# EAGLE design PCB_Nano (EAGLE 9.6.2)
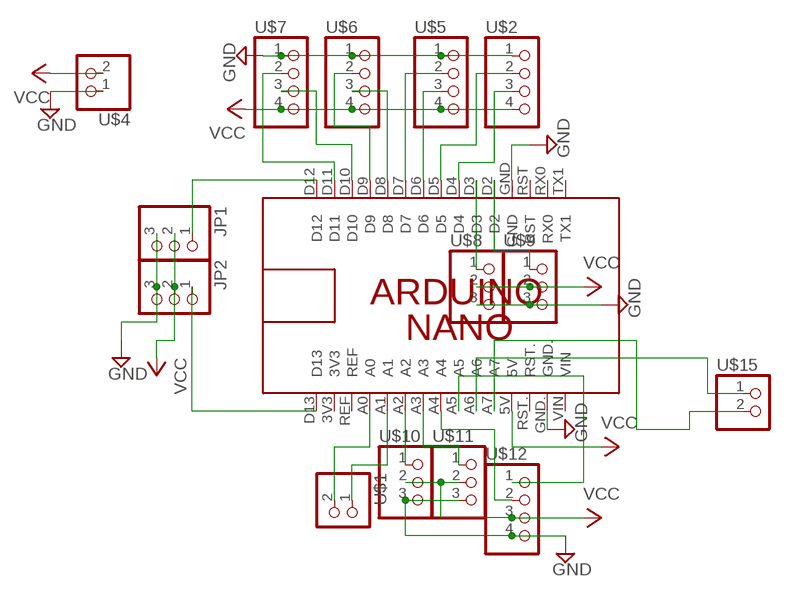
[diagram p0: schematic, sheet 1]

## Parts
JP1  PINHD-1X3  [1X03]
JP2  PINHD-1X3  [1X03]
PCB1  ARDUINO_NANO_SHIELD  [ARDUINO_NANO_W_HEADER_&_SOCKET]
U$1  PINHD-1X2  [1X02]
U$2  PINHD-1X4  [1X04]
U$4  TERMINALBLOCK_1X2-5.0MM  [TERMINALBLOCK_1X2-5.0MM]
U$5  PINHD-1X4  [1X04]
U$6  PINHD-1X4  [1X04]
U$7  PINHD-1X4  [1X04]
U$8  PINHD-1X3  [1X03]
U$9  PINHD-1X3  [1X03]
U$10  PINHD-1X3  [1X03]
U$11  PINHD-1X3  [1X03]
U$12  PINHD-1X4  [1X04]
U$15  PINHD-1X2  [1X02]

## Nets
GND: JP1.3 JP2.3 PCB1.GND PCB1.GND. U$2.1 U$4.1 U$5.1 U$6.1 U$7.1 U$8.3 U$9.3 U$10.3 U$11.3 U$12.4
N$1: PCB1.D4 U$2.3
N$2: PCB1.D5 U$2.2
N$3: PCB1.D6 U$5.3
N$4: PCB1.D7 U$5.2
N$5: PCB1.D8 U$6.3
N$6: PCB1.D9 U$6.2
N$7: PCB1.D10 U$7.3
N$8: PCB1.D11 U$7.2
N$9: PCB1.A1 U$1.1
N$10: PCB1.A0 U$1.2
N$11: PCB1.D3 U$8.1
N$12: PCB1.D2 U$9.1
N$13: JP1.1 PCB1.D12
N$14: JP2.1 PCB1.D13
N$15: PCB1.A2 U$10.1
N$16: PCB1.A3 U$11.1
N$17: PCB1.A4 U$12.2
N$18: PCB1.A5 U$12.1
N$19: PCB1.A6 U$15.1
N$20: PCB1.A7 U$15.2
VCC: JP1.2 JP2.2 PCB1.5V U$2.4 U$4.2 U$5.4 U$6.4 U$7.4 U$8.2 U$9.2 U$10.2 U$11.2 U$12.3
Unconnected: PCB1.3V3 PCB1.REF PCB1.RST PCB1.RST. PCB1.RX0 PCB1.TX1 PCB1.VIN

## Library data of the parts
JP1 JP2 U$8-U$11 = pinhead:PINHD-1X3: PIN HEADER
PCB1 = Arduino_Shield:ARDUINO_NANO_SHIELD: Base shield for Arduino Nano board.
U$1 U$15 = pinhead:PINHD-1X2: PIN HEADER
U$2 U$5-U$7 U$12 = pinhead:PINHD-1X4: PIN HEADER
U$4 = TerminalBlock:TERMINALBLOCK_1X2-5.0MM: 1x2-5.0MM TERMINAL BLOCK Simple screw terminal. 2 pins with 5.0mm pitch; PITCH: 5mm

## Board
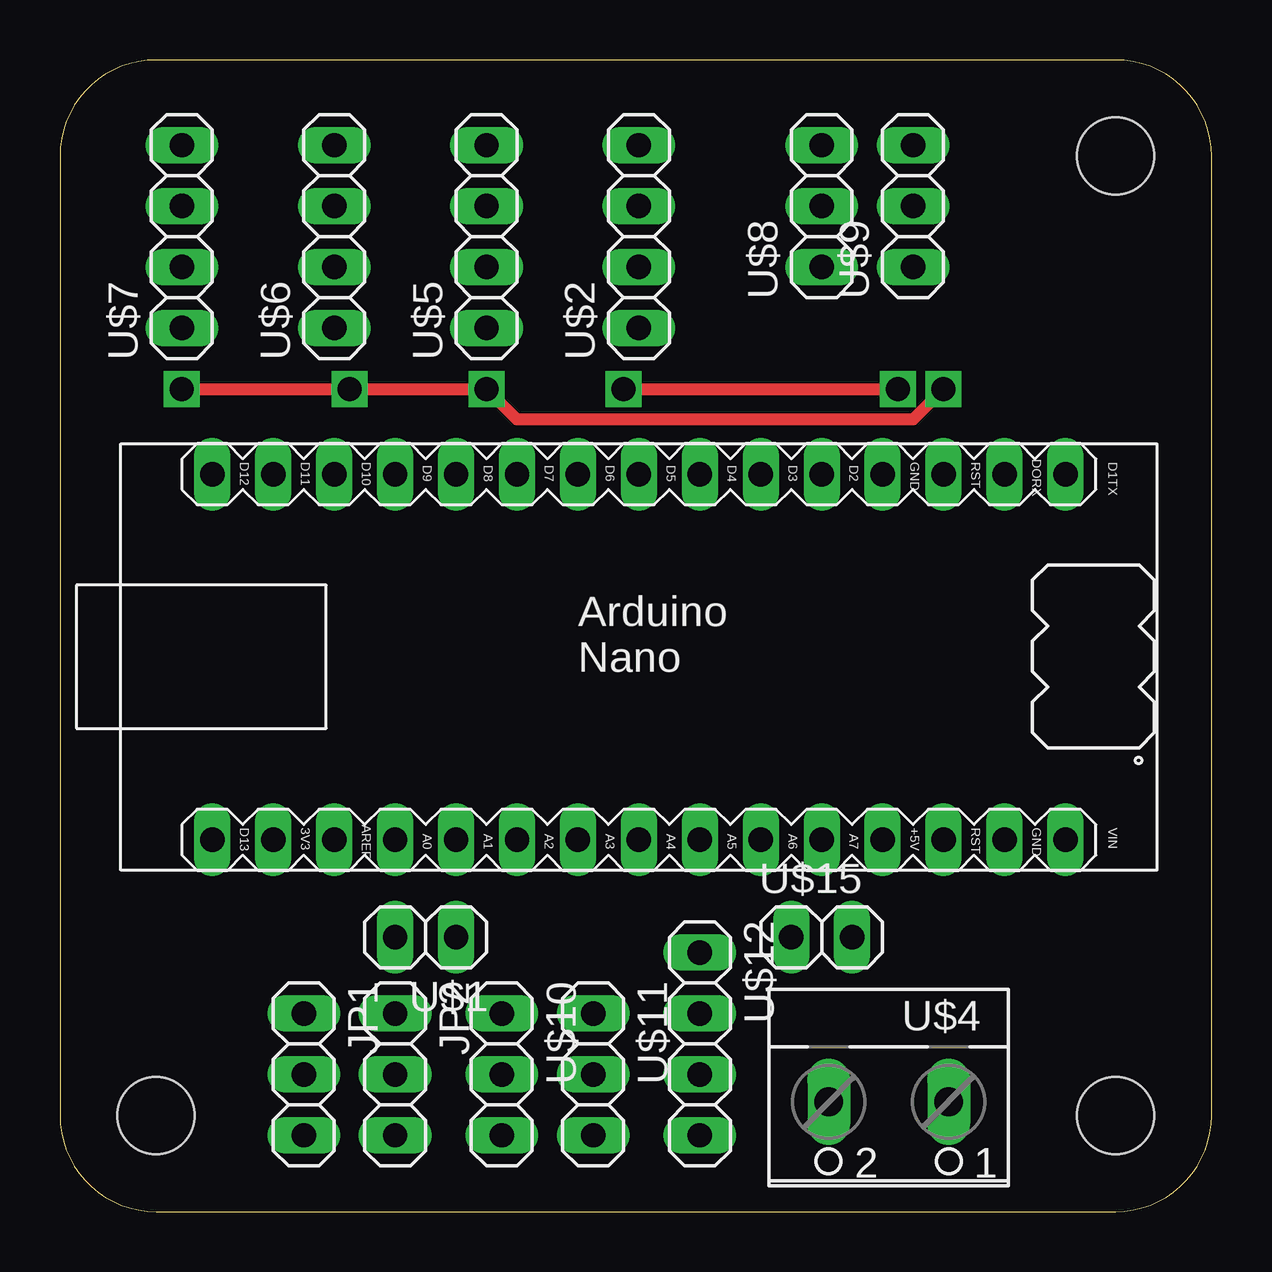
[diagram p1: board, top side]
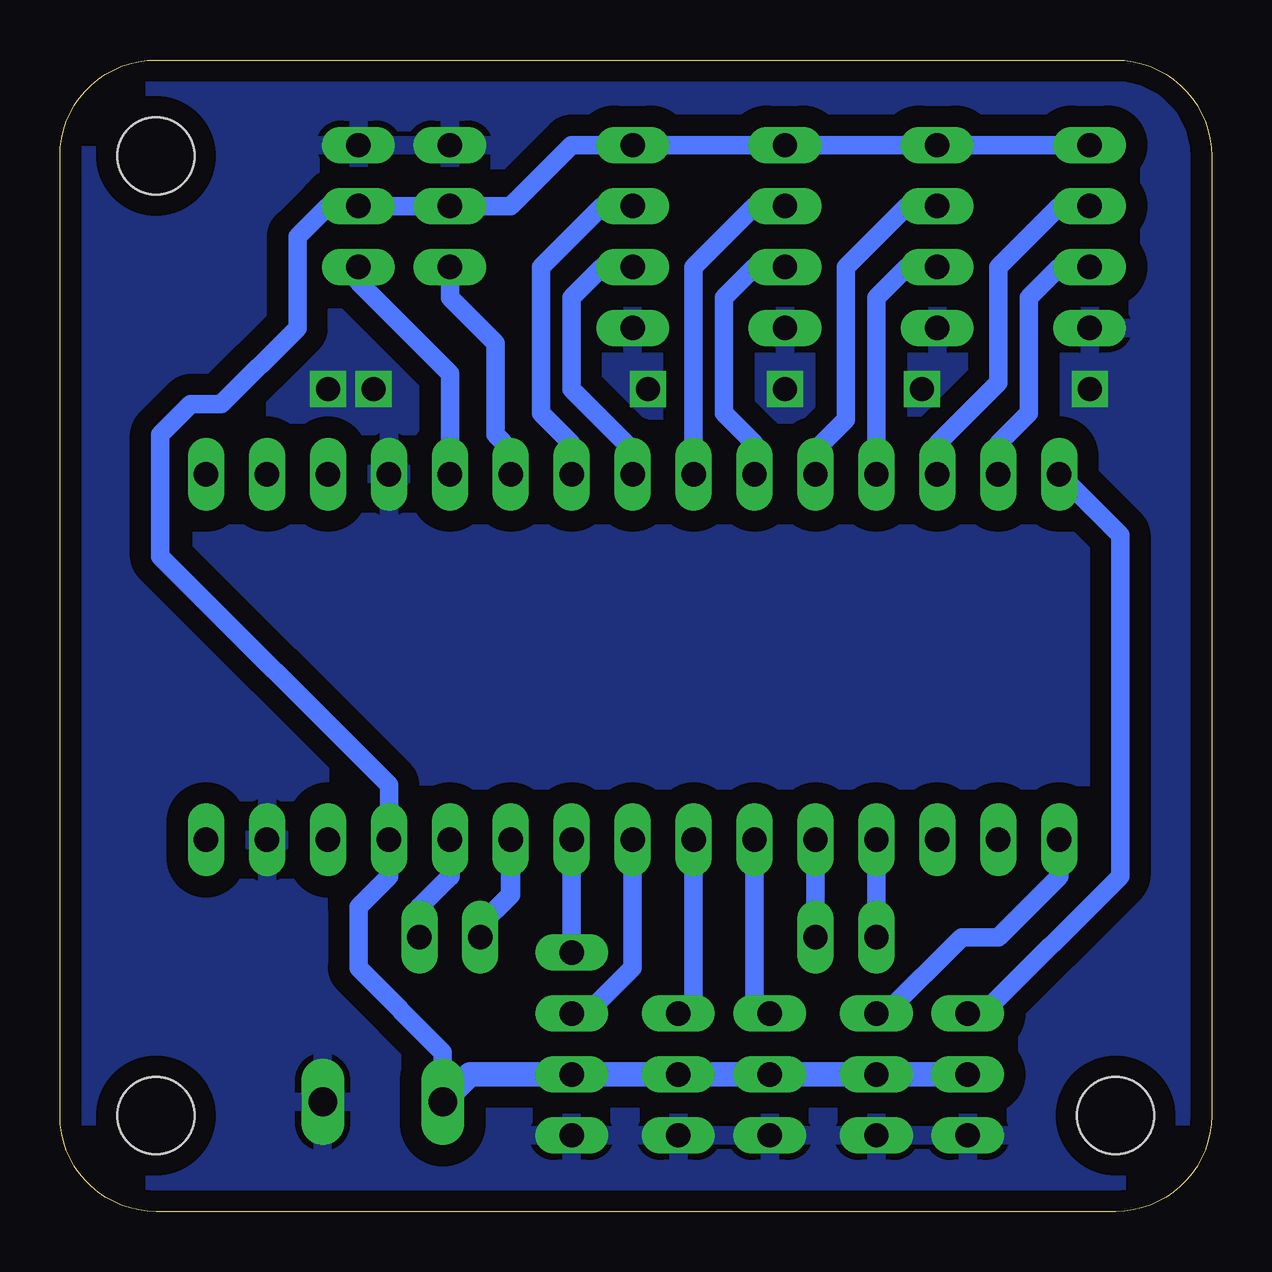
[diagram p2: board, bottom side, seen from below]

Size 48 x 48 mm. Coordinates in mm from the lower left corner, seen from the top.
Outline: 4,0 44,0 arc90 48,4 48,44 arc90 44,48 4,48 arc90 0,44 0,4 arc90 4,0
Copper layers (1*16): Top 0.035mm / dielectric 1.5mm / Bottom 0.035mm
Design rules "default *": minimum track width 6mil, minimum drill 0.35mm, track to track 6mil, track to pad 6mil, pad to pad 6mil, via to via 6mil, smd to smd 6mil, copper to edge 20mil, drill to drill 6mil, minimum pad ring 10mil, minimum via ring 8mil, stop-mask expansion 4mil, vias tented up to drill 0mil, thermal gap 10mil
Holes 3.2 mm at 44,44 44,4 4,4

### Footprints (pad centres in the part's own frame; a part is rotated, then mirrored left to right if it is on the bottom)
1X03 = drill 1.016 long: 1 -2.54,0; 2 0,0; 3 2.54,0
ARDUINO_NANO_W_HEADER_&_SOCKET = drill 1.016 long: 3V3 6.35,1.27; 5V 31.75,1.27; A0 11.43,1.27; A1 13.97,1.27; A2 16.51,1.27; A3 19.05,1.27; A4 21.59,1.27; A5 24.13,1.27; A6 26.67,1.27; A7 29.21,1.27; D2 29.21,16.51; D3 26.67,16.51; D4 24.13,16.51; D5 21.59,16.51; D6 19.05,16.51; D7 16.51,16.51; D8 13.97,16.51; D9 11.43,16.51; D10 8.89,16.51; D11 6.35,16.51; D12 3.81,16.51; D13 3.81,1.27; GND 31.75,16.51; GND. 36.83,1.27; REF 8.89,1.27; RST 34.29,16.51; RST. 34.29,1.27; RX0 36.83,16.51; TX1 39.37,16.51; VIN 39.37,1.27
1X02 = drill 1.016 long: 1 -1.27,0; 2 1.27,0
1X04 = drill 1.016 long: 1 -3.81,0; 2 -1.27,0; 3 1.27,0; 4 3.81,0
TERMINALBLOCK_1X2-5.0MM = drill 1.2 long: 1 -2.5,0; 2 2.5,0

### Placement (x,y rotation side)
JP1  10.16,5.71 270 top
JP2  13.97,5.71 270 top
PCB1  2.54,14.22 0 top
U$1  15.24,11.43 180 top
U$2  24.13,40.64 90 top
U$4  34.54,4.57 180 top
U$5  17.78,40.64 90 top
U$6  11.43,40.64 90 top
U$7  5.08,40.64 90 top
U$8  31.75,41.91 90 top
U$9  35.56,41.91 90 top
U$10  18.41,5.71 270 top
U$11  22.23,5.71 270 top
U$12  26.67,6.99 270 top
U$15  31.75,11.43 0 top

### Tracks (layer width: path | path; a pad name or v marks a point on that pad's centre or on a via)
GND  (via drill 1)
  Top 0.508: v5.08,34.29 v12.06,34.29 v17.78,34.29 19.05,33.02 35.56,33.02 v36.83,34.29 | v23.5,34.29 v34.92,34.29
  pour Bottom: 6.48,18.41 6.48,26.8 7.62,27.94 34.29,27.94 34.29,20.32 32.38,18.41
  pour Bottom (isolate 0.889): 0,4 arc90 4,0 44,0 arc90 48,4 48,44 arc90 44,48 4,48 arc90 0,44
N$1
  Bottom 0.762: PCB1.D4 26.67,32 27.94,33.27 27.94,39.37 25.4,41.91 U$2.3
N$2
  Bottom 0.762: PCB1.D5 24.13,31.75 26.67,34.29 26.67,38.1 25.4,39.37 U$2.2
N$3
  Bottom 0.762: PCB1.D6 21.59,39.37 19.05,41.91 U$5.3
N$4
  Bottom 0.762: PCB1.D7 19.05,32 20.32,33.27 20.32,38.1 19.05,39.37 U$5.2
N$5
  Bottom 0.762: PCB1.D8 16.51,31.75 15.24,33.02 15.24,39.37 12.7,41.91 U$6.3
N$6
  Bottom 0.762: PCB1.D9 13.97,38.1 12.7,39.37 U$6.2
N$7
  Bottom 0.762: PCB1.D10 11.43,32 8.89,34.54 8.89,39.37 6.35,41.91 U$7.3
N$8
  Bottom 0.762: PCB1.D11 8.89,32 7.62,33.27 7.62,38.1 6.35,39.37 U$7.2
N$9
  Bottom 0.762: U$1.1 PCB1.A1
N$10
  Bottom 0.762: U$1.2 PCB1.A0
N$11
  Bottom 0.762: PCB1.D3 29.21,31.75 29.84,32.38 29.84,36.2 31.75,38.1 U$8.1
N$12
  Bottom 0.762: PCB1.D2 31.75,34.92 35.56,38.73 U$9.1
N$13
  Bottom 0.762: PCB1.D12 3.81,28.19 3.81,13.97 9.53,8.26 JP1.1
N$14
  Bottom 0.762: PCB1.D13 6.35,13.97 8.89,11.43 10.41,11.43 13.59,8.26 JP2.1
N$15
  Bottom 0.762: PCB1.A2 19.05,8.89 U$10.1
N$16
  Bottom 0.762: PCB1.A3 21.59,8.89 U$11.1
N$17
  Bottom 0.762: PCB1.A4 24.13,10.16 26.04,8.26 U$12.2
N$18
  Bottom 0.762: PCB1.A5 U$12.1
N$19
  Bottom 0.813: U$15.1 30.48,11.94 29.21,13.21 PCB1.A6
N$20
  Bottom 0.813: U$15.2 33.02,12.7 31.75,13.97 PCB1.A7
VCC
  Bottom 0.762: U$7.4 U$6.4 U$5.4 U$2.4 26.67,44.45 29.21,41.91 U$8.2 U$9.2 36.83,41.91 38.1,40.64 38.1,36.83 41.27,33.66 42.55,33.66 43.81,32.38 43.81,27.3 34.29,17.78 PCB1.5V 34.29,13.97 35.56,12.7 35.56,10.16 32.04,6.64 U$4.2
  Bottom 1.016: JP1.2 JP2.2 U$10.2 U$11.2 U$12.3 30.9,5.71 U$4.2

### Text on the board
bRestrict: Super Secrétaire / - Robotik 2022